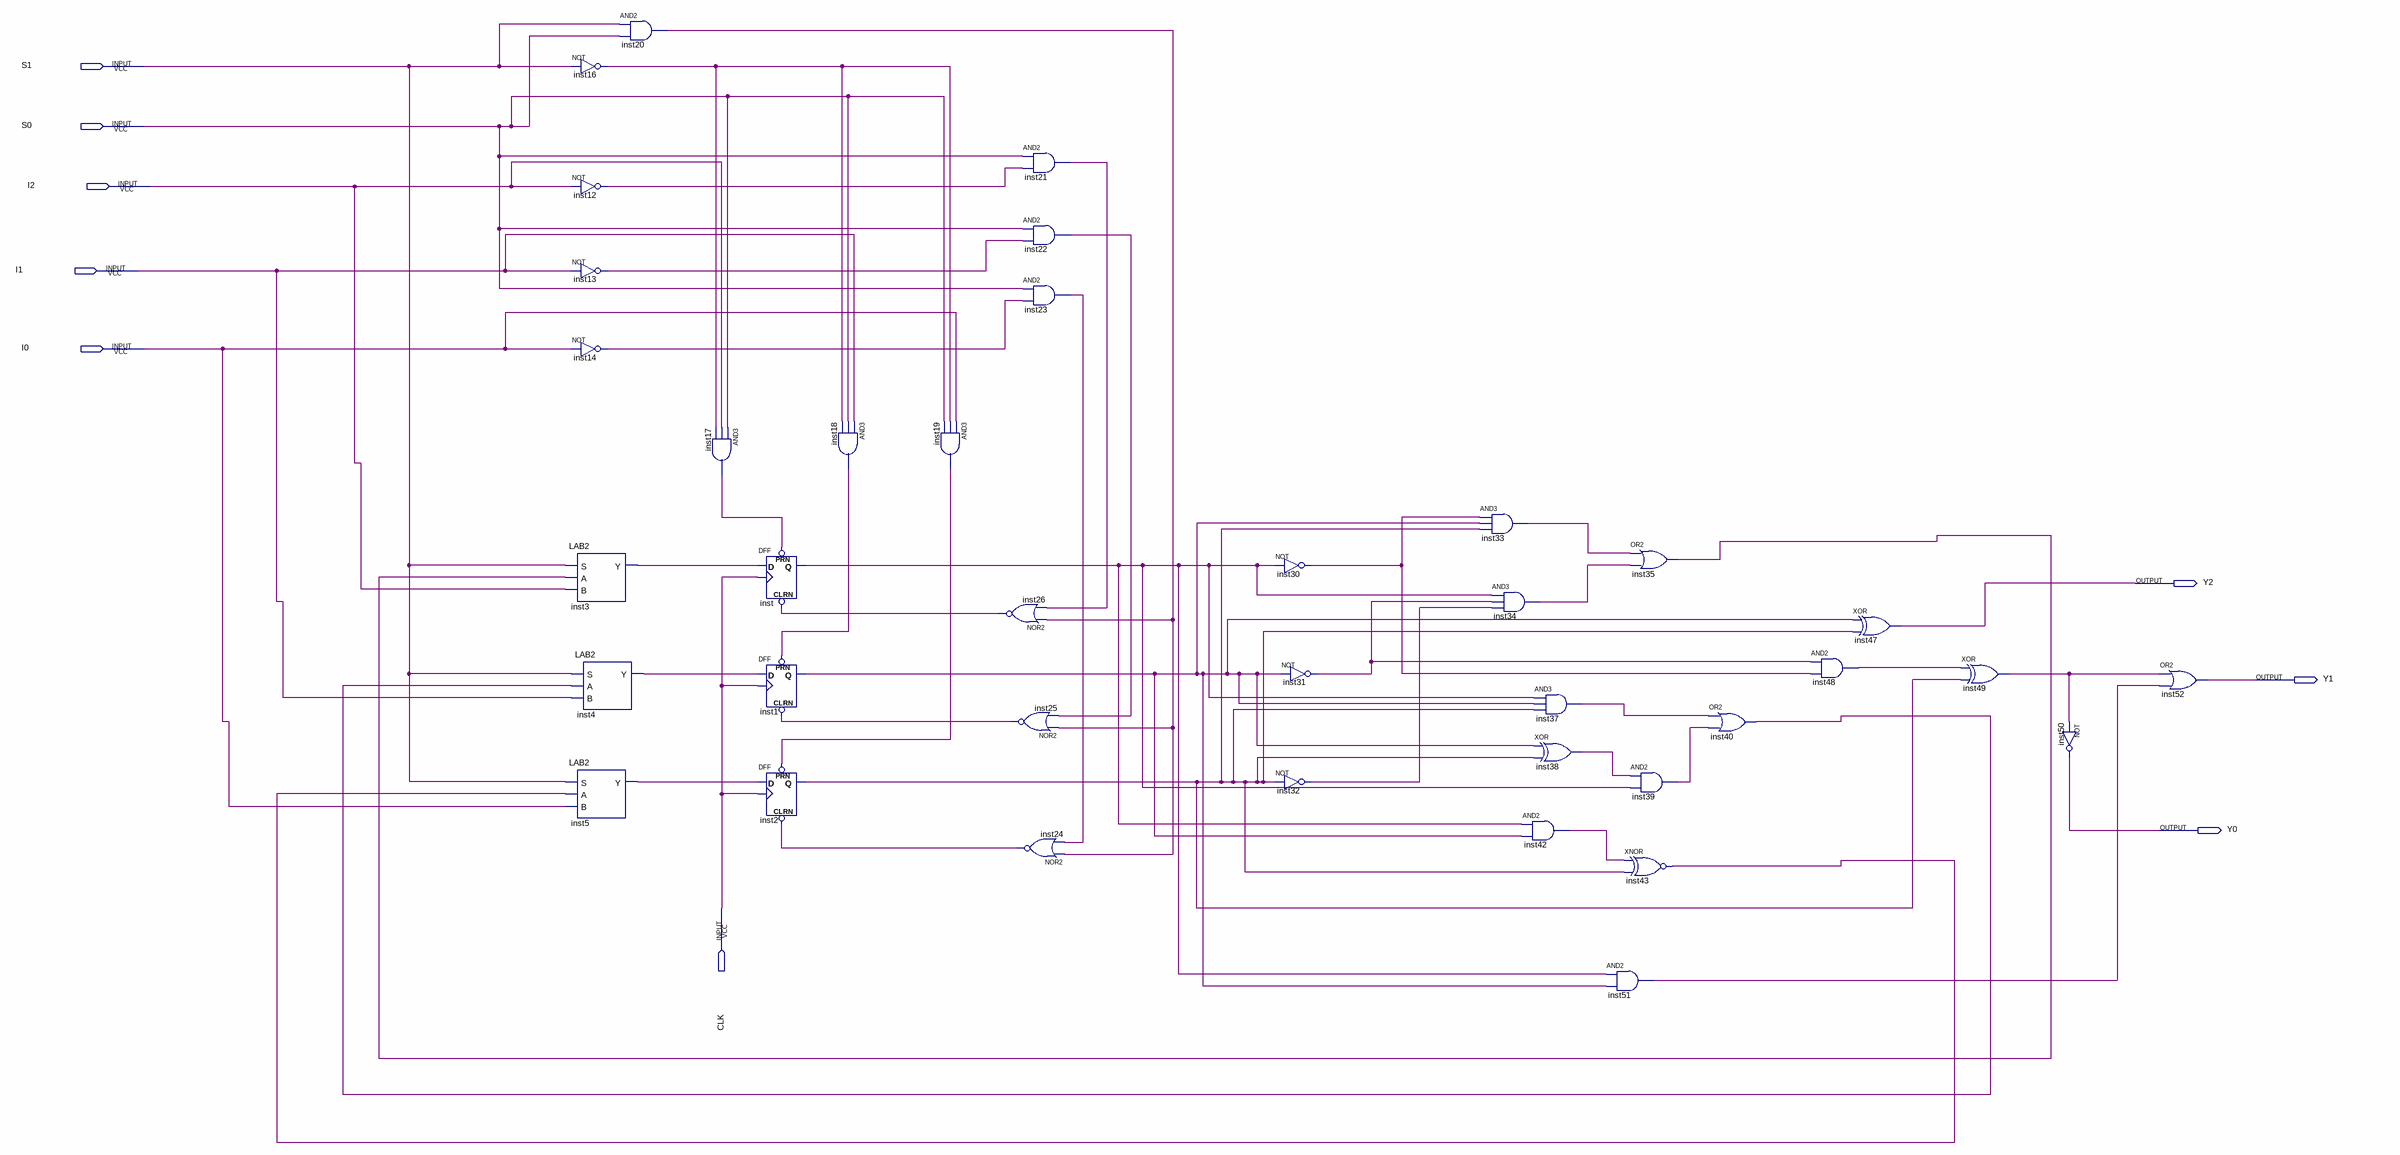
[diagram p0: schematic sheet]
// Quartus schematic lab1_hihi.bdf as structural Verilog: 38 symbols, 9 pins
module lab1_hihi (
  input  S1,
  input  S0,
  input  I2,
  input  I1,
  input  I0,
  input  CLK,
  output Y2,
  output Y1,
  output Y0
);

  wire inst1_q, inst2_q, inst3_y, inst4_y, inst5_y, inst12_out, inst13_out, inst14_out, inst16_out,
       inst17_out, inst18_out, inst19_out, inst20_out, inst21_out, inst22_out, inst23_out, inst24_out,
       inst25_out, inst26_out, inst30_out, inst31_out, inst32_out, inst33_out, inst34_out, inst35_out,
       inst37_out, inst38_out, inst39_out, inst40_out, inst42_out, inst43_out, inst48_out, inst49_out,
       inst51_out, inst_q;

  not inst16 (inst16_out, S1);
  not inst12 (inst12_out, I2);
  not inst13 (inst13_out, I1);
  not inst14 (inst14_out, I0);
  LAB2 inst3 (.S(S1), .A(inst35_out), .B(I2), .Y(inst3_y));
  LAB2 inst4 (.S(S1), .A(inst40_out), .B(I1), .Y(inst4_y));
  LAB2 inst5 (.S(S1), .A(inst43_out), .B(I0), .Y(inst5_y));
  and inst20 (inst20_out, S1, S0);
  and inst17 (inst17_out, S0, I2, inst16_out);
  DFF inst (.CLRN(inst26_out), .CLK(CLK), .D(inst3_y), .PRN(inst17_out), .Q(inst_q));
  DFF inst1 (.CLRN(inst25_out), .CLK(CLK), .D(inst4_y), .PRN(inst18_out), .Q(inst1_q));
  DFF inst2 (.CLRN(inst24_out), .CLK(CLK), .D(inst5_y), .PRN(inst19_out), .Q(inst2_q));
  and inst18 (inst18_out, I1, S0, inst16_out);
  and inst19 (inst19_out, I0, inst16_out, S0);
  nor inst26 (inst26_out, inst20_out, inst21_out);
  nor inst25 (inst25_out, inst20_out, inst22_out);
  nor inst24 (inst24_out, inst20_out, inst23_out);
  and inst21 (inst21_out, S0, inst12_out);
  and inst22 (inst22_out, S0, inst13_out);
  and inst23 (inst23_out, S0, inst14_out);
  not inst30 (inst30_out, inst_q);
  not inst31 (inst31_out, inst1_q);
  not inst32 (inst32_out, inst2_q);
  and inst33 (inst33_out, inst30_out, inst1_q, inst2_q);
  and inst34 (inst34_out, inst_q, inst31_out, inst32_out);
  and inst37 (inst37_out, inst_q, inst1_q, inst2_q);
  xor inst38 (inst38_out, inst1_q, inst2_q);
  and inst42 (inst42_out, inst_q, inst1_q);
  or inst35 (inst35_out, inst33_out, inst34_out);
  and inst39 (inst39_out, inst38_out, inst_q);
  xnor inst43 (inst43_out, inst42_out, inst2_q);
  and inst51 (inst51_out, inst_q, inst1_q);
  or inst40 (inst40_out, inst37_out, inst39_out);
  and inst48 (inst48_out, inst31_out, inst30_out);
  xor inst47 (Y2, inst1_q, inst2_q);
  xor inst49 (inst49_out, inst48_out, inst2_q);
  not inst50 (Y0, inst49_out);
  or inst52 (Y1, inst49_out, inst51_out);
endmodule
